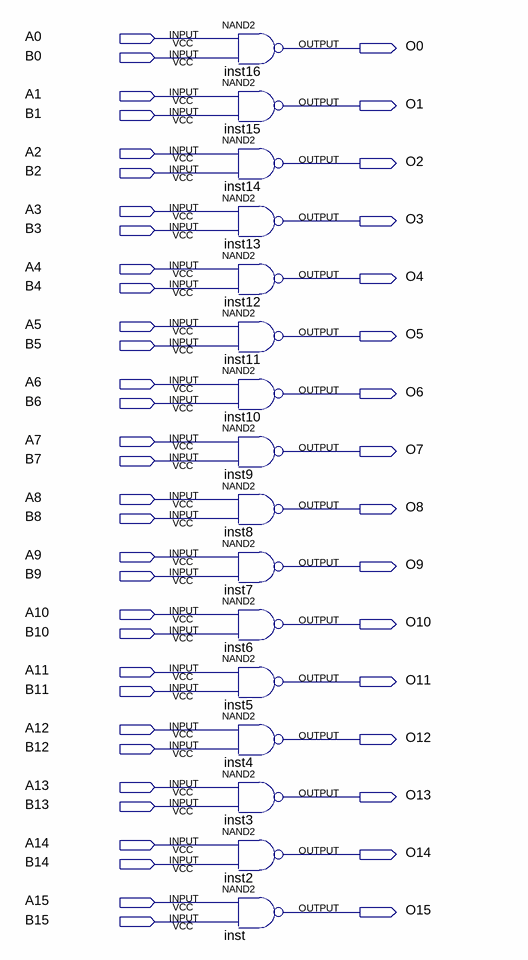
[diagram p0: schematic sheet]
// Quartus schematic Nand_16bit.bdf as structural Verilog: 16 symbols, 48 pins
module Nand_16bit (
  input  A0,
  input  B0,
  input  A1,
  input  B1,
  input  A2,
  input  B2,
  input  A3,
  input  B3,
  input  A4,
  input  B4,
  input  A5,
  input  B5,
  input  A6,
  input  B6,
  input  A7,
  input  B7,
  input  A8,
  input  B8,
  input  A9,
  input  B9,
  input  A10,
  input  B10,
  input  A11,
  input  B11,
  input  A12,
  input  B12,
  input  A13,
  input  B13,
  input  A14,
  input  B14,
  input  A15,
  input  B15,
  output O0,
  output O1,
  output O2,
  output O3,
  output O4,
  output O5,
  output O6,
  output O7,
  output O8,
  output O9,
  output O10,
  output O11,
  output O12,
  output O13,
  output O14,
  output O15
);

  nand inst16 (O0, A0, B0);
  nand inst15 (O1, A1, B1);
  nand inst14 (O2, A2, B2);
  nand inst13 (O3, A3, B3);
  nand inst12 (O4, A4, B4);
  nand inst11 (O5, A5, B5);
  nand inst10 (O6, A6, B6);
  nand inst9 (O7, A7, B7);
  nand inst8 (O8, A8, B8);
  nand inst7 (O9, A9, B9);
  nand inst6 (O10, A10, B10);
  nand inst5 (O11, A11, B11);
  nand inst4 (O12, A12, B12);
  nand inst3 (O13, A13, B13);
  nand inst2 (O14, A14, B14);
  nand inst (O15, A15, B15);
endmodule
